# EAGLE design diy_mainboard (EAGLE 6.6.0)
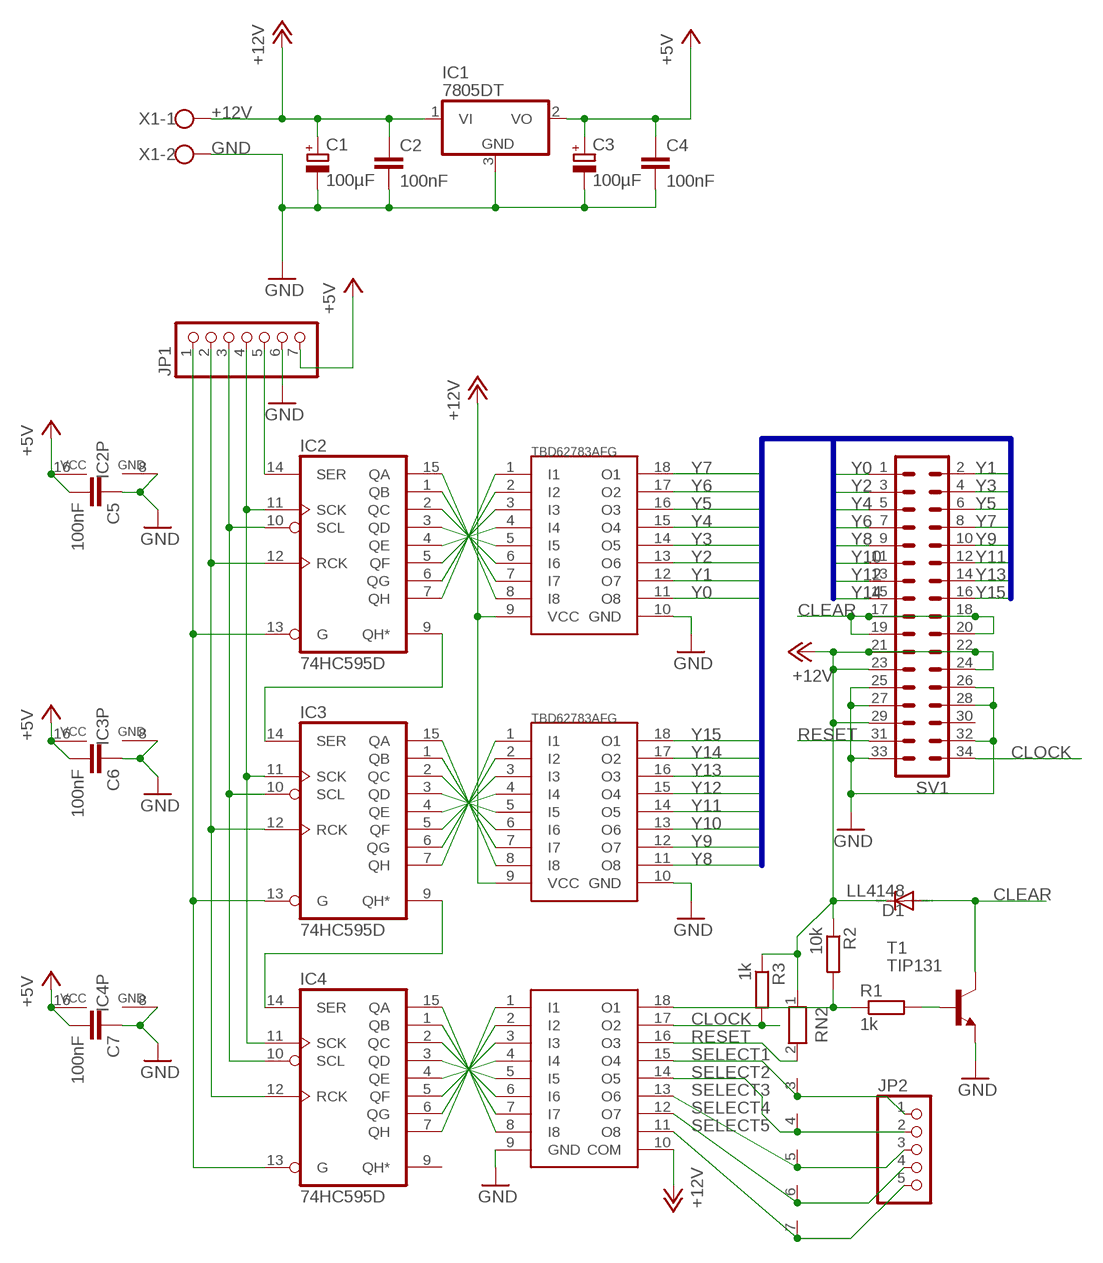
[diagram p0: schematic, sheet 1]

## Parts
C1  100µF  CPOL-EU153CLV-0605  [153CLV-0605]
C2  100nF  C-EUC0603  [C0603]
C3  100µF  CPOL-EU153CLV-0605  [153CLV-0605]
C4  100nF  C-EUC0603  [C0603]
C5  100nF  C-EUC0603  [C0603]
C6  100nF  C-EUC0603  [C0603]
C7  100nF  C-EUC0603  [C0603]
D1  LL4148  PMLL4150  [SOD80C]
IC1  7805DT  [TO252]
IC2  74HC595D  [SO16]
IC3  74HC595D  [SO16]
IC4  74HC595D  [SO16]
JP1  PINHD-1X7  [1X07]
JP2  PINHD-1X5  [1X05]
R1  1k  R-EU_R0805  [R0805]
R2  10k  R-EU_R0805  [R0805]
R3  1k  R-EU_R0805  [R0805]
RN2  RN06  [RN-7]
SV1  ML34  [ML34]
T1  TIP131  2SC1306  [TO220BV]
U$1  TBD62783AFG  [SO8-L]
U$2  TBD62783AFG  [SO8-L]
U$3  ULN2803  [SO8-L]
X1  W237-102  [W237-102]

## Nets
+5V: C3.+ C4.1 C5.2 C6.2 C7.2 IC1.2(VO) IC2.16(VCC) IC3.16(VCC) IC4.16(VCC) JP1.7
+12V: C1.+ C2.1 D1.C IC1.1(VI) R2.1 R3.1 RN2.1 SV1.21 SV1.22 SV1.23 SV1.24 SV1.29 U$1.9(VCC) U$2.9(VCC) U$3.10(COM) X1.1
CLEAR: D1.A SV1.17 SV1.18 SV1.19 SV1.20 T1.2(C)
CLOCK: R3.2 SV1.34 U$3.17(O2)
GND: C1.- C2.2 C3.- C4.2 C5.1 C6.1 C7.1 IC1.3(GND) IC2.8(GND) IC3.8(GND) IC4.8(GND) JP1.6 SV1.25 SV1.26 SV1.27 SV1.28 SV1.32 SV1.33 T1.3(E) U$1.10(GND) U$2.10(GND) U$3.9(GND) X1.2
N$1: IC2.15(QA) U$1.8(I8)
N$2: IC2.1(QB) U$1.7(I7)
N$3: IC2.2(QC) U$1.6(I6)
N$4: IC2.3(QD) U$1.5(I5)
N$5: IC2.4(QE) U$1.4(I4)
N$6: IC2.5(QF) U$1.3(I3)
N$7: IC2.6(QG) U$1.2(I2)
N$8: IC2.7(QH) U$1.1(I1)
N$9: IC3.15(QA) U$2.8(I8)
N$10: IC3.1(QB) U$2.7(I7)
N$11: IC3.2(QC) U$2.6(I6)
N$12: IC3.3(QD) U$2.5(I5)
N$13: IC3.4(QE) U$2.4(I4)
N$14: IC3.5(QF) U$2.3(I3)
N$15: IC3.6(QG) U$2.2(I2)
N$16: IC3.7(QH) U$2.1(I1)
N$17: IC2.9(QH*) IC3.14(SER)
N$18: IC2.11(SCK) IC3.11(SCK) IC4.11(SCK) JP1.4
N$19: IC2.10(SCL) IC3.10(SCL) IC4.10(SCL) JP1.3
N$20: IC2.12(RCK) IC3.12(RCK) IC4.12(RCK) JP1.2
N$21: IC2.13(G) IC3.13(G) IC4.13(G) JP1.1
N$22: IC3.9(QH*) IC4.14(SER)
N$23: IC4.15(QA) U$3.8(I8)
N$24: IC4.1(QB) U$3.7(I7)
N$25: IC4.2(QC) U$3.6(I6)
N$26: IC4.3(QD) U$3.5(I5)
N$27: IC4.4(QE) U$3.4(I4)
N$28: IC4.5(QF) U$3.3(I3)
N$29: IC4.6(QG) U$3.2(I2)
N$30: IC4.7(QH) U$3.1(I1)
N$31: R1.2 T1.1(B)
N$32: R1.1 R2.2 U$3.18(O1)
N$33: IC2.14(SER) JP1.5
RESET: RN2.2 SV1.31 U$3.16(O3)
SELECT1: JP2.1 RN2.3 U$3.15(O4)
SELECT2: JP2.2 RN2.4 U$3.14(O5)
SELECT3: JP2.3 RN2.5 U$3.13(O6)
SELECT4: JP2.4 RN2.6 U$3.12(O7)
SELECT5: JP2.5 RN2.7 U$3.11(O8)
Y0: SV1.1 U$1.11(O8)
Y1: SV1.2 U$1.12(O7)
Y2: SV1.3 U$1.13(O6)
Y3: SV1.4 U$1.14(O5)
Y4: SV1.5 U$1.15(O4)
Y5: SV1.6 U$1.16(O3)
Y6: SV1.7 U$1.17(O2)
Y7: SV1.8 U$1.18(O1)
Y8: SV1.9 U$2.11(O8)
Y9: SV1.10 U$2.12(O7)
Y10: SV1.11 U$2.13(O6)
Y11: SV1.12 U$2.14(O5)
Y12: SV1.13 U$2.15(O4)
Y13: SV1.14 U$2.16(O3)
Y14: SV1.15 U$2.17(O2)
Y15: SV1.16 U$2.18(O1)
Unconnected: IC4.9(QH*) SV1.30

## Buses
Y[0..15]

## Library data of the parts
C1 C3 = rcl:CPOL-EU: POLARIZED CAPACITOR, European symbol; DIGIKEY: 493-2203-1-ND
C2 C4-C7 = rcl:C-EU: CAPACITOR, European symbol; DIGIKEY: 478-5052-1-ND
D1 = diode:PMLL4150: DIODE high speed; DIGIKEY: LL4148FSCT-ND
IC1 = linear:78*: Positive VOLTAGE REGULATOR Source: http://cache.national.com/ds/LM/LM78L05.pdf http://www.fairchildsemi.com/ds/LM/LM7805.pdf; DIGIKEY: MC7805CDTGOS-ND
IC2-IC4 = 74xx-eu:74*595: 8-bit SHIFT REGISTER, output latch; DIGIKEY: 568-2263-1-ND
JP1 = pinhead:PINHD-1X7: PIN HEADER; DIGIKEY: A101735CT-ND
JP2 = pinhead:PINHD-1X5: PIN HEADER; DIGIKEY: A101735CT-ND
R1 R3 = rcl:R-EU_: RESISTOR, European symbol; DIGIKEY: RMCF0805JT1K00CT-ND
R2 = rcl:R-EU_: RESISTOR, European symbol; DIGIKEY: RMCF0805JT10K0CT-ND
RN2 = resistor-net:RN06: RESISTOR NETWORK; DIGIKEY: 4607X-101-472LF-ND; OC_FARNELL: unknown; OC_NEWARK: unknown
SV1 = con-harting-ml:ML34: HARTING; DIGIKEY: AE11226-ND; OC_FARNELL: unknown; OC_NEWARK: unknown
T1 = transistor:2SC1306: NPN Transistor Final RF Power Outupt Source: 2sc1306.pdf
U$1 U$2 = DIY:TBD62783AFG; DIGIKEY: TBD62783AFGELCT-ND
U$3 = DIY:ULN2803; DIGIKEY: 296-15777-1-ND
X1 = con-wago-500:W237-102: WAGO SCREW CLAMP; MPN: 237-102; OC_FARNELL: unknown; OC_NEWARK: 70K9898

## Board
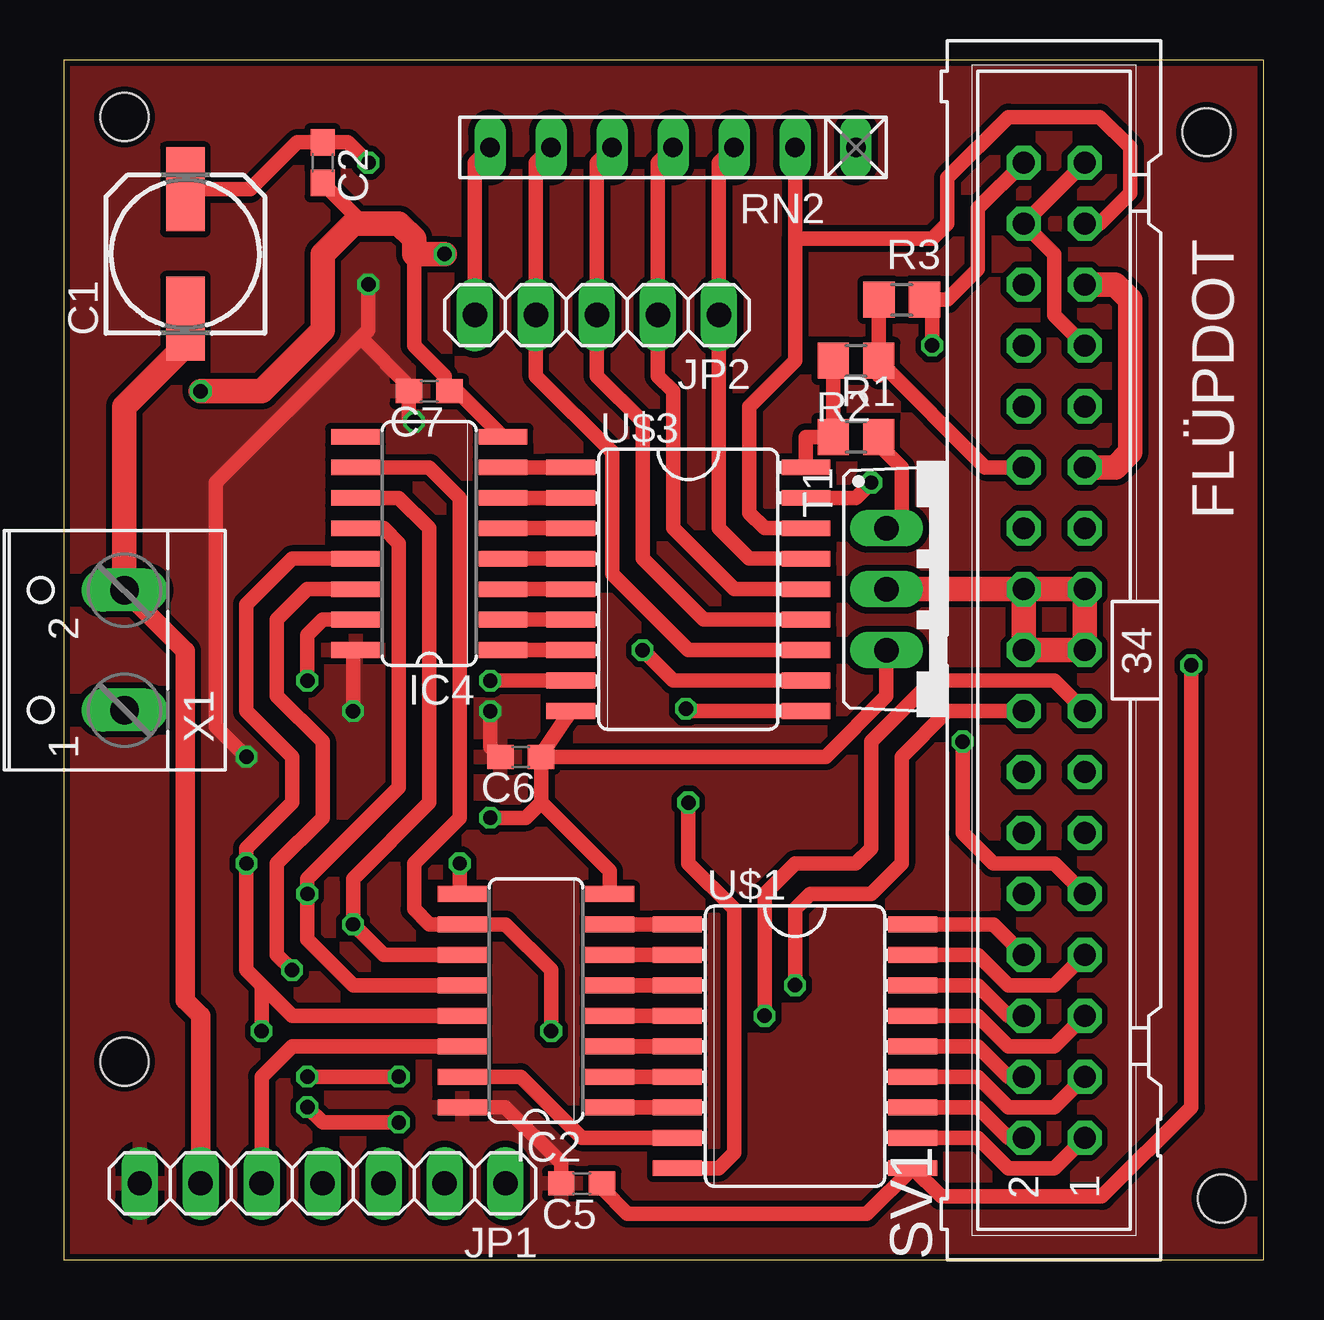
[diagram p1: board, top side]
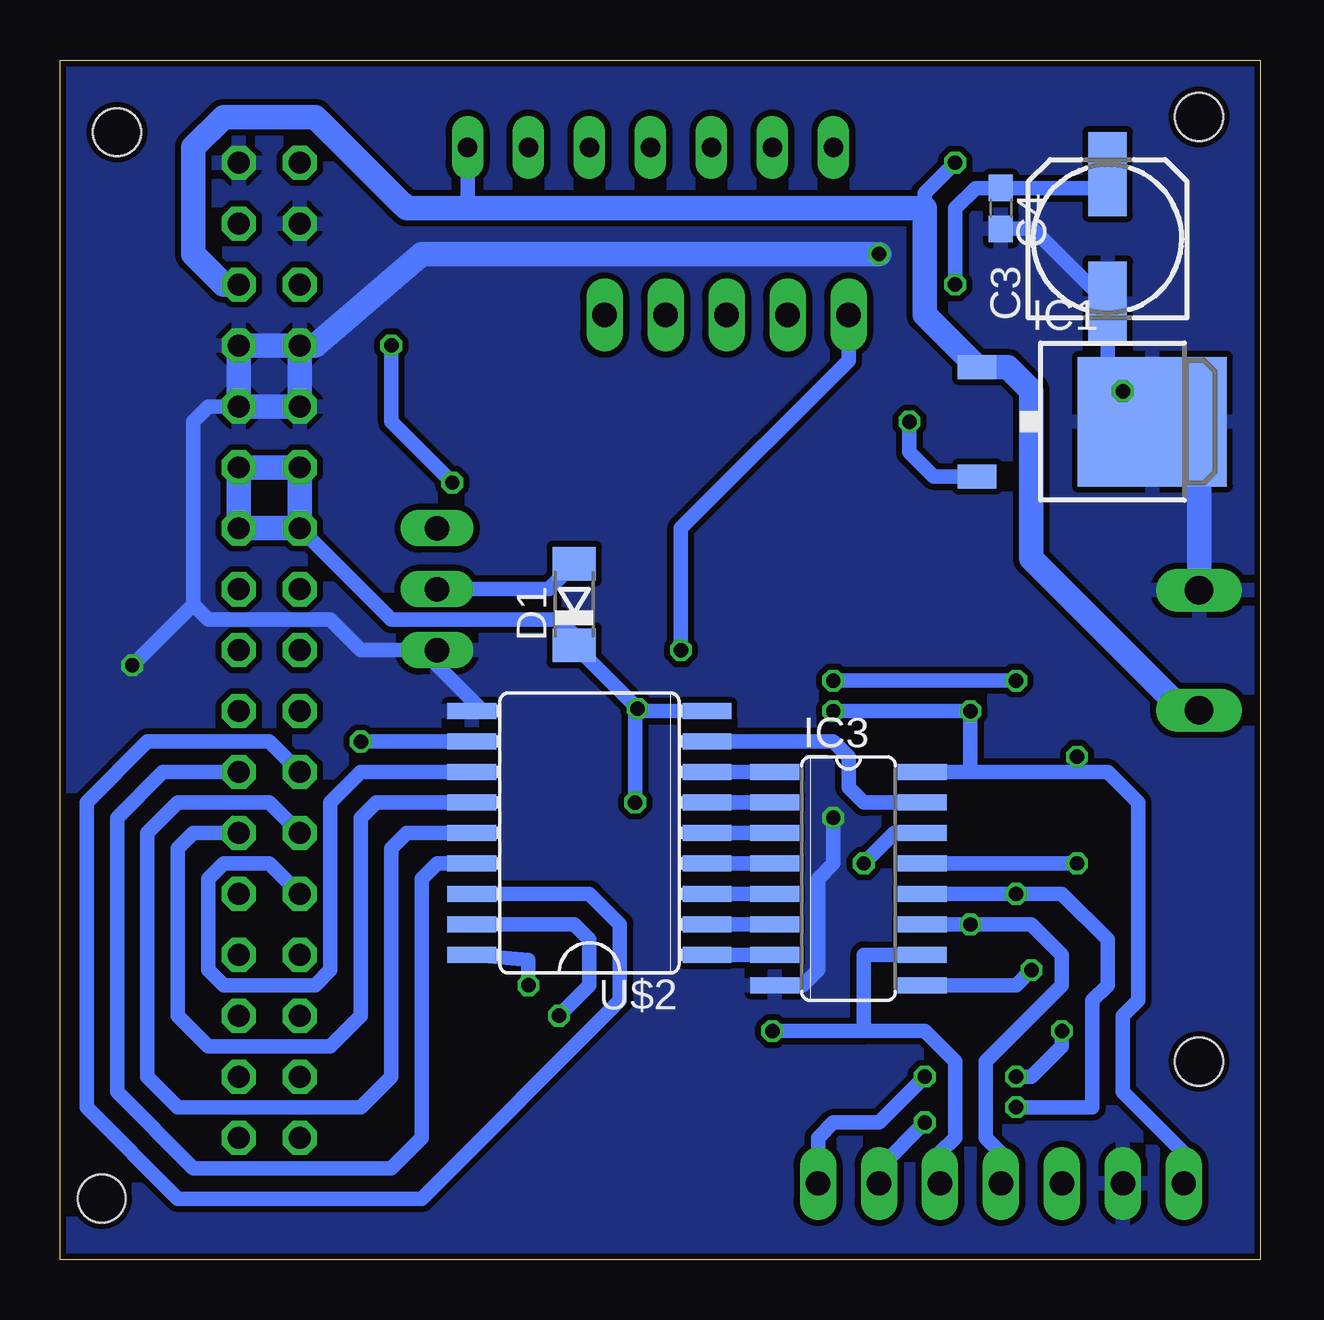
[diagram p2: board, bottom side, seen from below]

Size 50 x 50 mm. Coordinates in mm from the lower left corner, seen from the top.
Outline: 0,0 50,0 50,50 0,50 0,0
Copper layers (1*16): Top 0.035mm / dielectric 1.5mm / Bottom 0.035mm
Design rules "dirt_cheap_dirty_boards.v1": minimum track width 5mil, minimum drill 12mil, track to track 5mil, track to pad 5mil, pad to pad 5mil, via to via 5mil, smd to smd 0mil, copper to edge 10mil, drill to drill 10mil, minimum pad ring 10mil, minimum via ring 6mil, stop-mask expansion 2mil, vias tented up to drill 25mil, thermal gap 10mil
Holes 2 mm at 47.62,46.99 2.54,8.26 2.54,47.62 48.26,2.54

### Footprints (pad centres in the part's own frame; a part is rotated, then mirrored left to right if it is on the bottom)
153CLV-0605 = smd 3.5 x 1.6: + 2.7,0; - -2.7,0
C0603 = smd 1.1 x 1: 1 -0.85,0; 2 0.85,0
SOD80C = smd 1.4 x 1.8: A 1.7,0; C -1.7,0
TO252 = smd 1 x 1.6: 1 -2.28,-4.8; 2 2.28,-4.8 | smd 5.4 x 6.2: 3 0,2.5
SO16 = smd 0.66 x 2.032: 1 -4.445,-3.073; 2 -3.175,-3.073; 3 -1.905,-3.073; 4 -0.635,-3.073; 5 0.635,-3.073; 6 1.905,-3.073; 7 3.175,-3.073; 8 4.445,-3.073; 9 4.445,3.073; 10 3.175,3.073; 11 1.905,3.073; 12 0.635,3.073; 13 -0.635,3.073; 14 -1.905,3.073; 15 -3.175,3.073; 16 -4.445,3.073
1X07 = drill 1.016 long: 1 -7.62,0; 2 -5.08,0; 3 -2.54,0; 4 0,0; 5 2.54,0; 6 5.08,0; 7 7.62,0
1X05 = drill 1.016 long: 1 -5.08,0; 2 -2.54,0; 3 0,0; 4 2.54,0; 5 5.08,0
R0805 = smd 1.3 x 1.5: 1 -0.95,0; 2 0.95,0
RN-7 = drill 0.813 long: 1 -7.62,0; 2 -5.08,0; 3 -2.54,0; 4 0,0; 5 2.54,0; 6 5.08,0; 7 7.62,0
ML34 = drill 0.914 octagon: 1 -20.32,-1.27; 2 -20.32,1.27; 3 -17.78,-1.27; 4 -17.78,1.27; 5 -15.24,-1.27; 6 -15.24,1.27; 7 -12.7,-1.27; 8 -12.7,1.27; 9 -10.16,-1.27; 10 -10.16,1.27; 11 -7.62,-1.27; 12 -7.62,1.27; 13 -5.08,-1.27; 14 -5.08,1.27; 15 -2.54,-1.27; 16 -2.54,1.27; 17 0,-1.27; 18 0,1.27; 19 2.54,-1.27; 20 2.54,1.27; 21 5.08,-1.27; 22 5.08,1.27; 23 7.62,-1.27; 24 7.62,1.27; 25 10.16,-1.27; 26 10.16,1.27; 27 12.7,-1.27; 28 12.7,1.27; 29 15.24,-1.27; 30 15.24,1.27; 31 17.78,-1.27; 32 17.78,1.27; 33 20.32,-1.27; 34 20.32,1.27
TO220BV = drill 1.016 long: 1 -2.54,-2.54; 2 0,-2.54; 3 2.54,-2.54
SO8-L = smd 0.66 x 2.032: 1 -5.08,-4.902; 2 -3.81,-4.902; 3 -2.54,-4.902; 4 -1.27,-4.902; 5 0,-4.902; 6 1.27,-4.902; 7 2.54,-4.902; 8 3.81,-4.902; 9 5.08,-4.902; 10 5.08,4.902; 11 3.81,4.902; 12 2.54,4.902; 13 1.27,4.902; 14 0,4.902; 15 -1.27,4.902; 16 -2.54,4.902; 17 -3.81,4.902; 18 -5.08,4.902
W237-102 = drill 1.194 long: 1 -2.5,-1.27; 2 2.5,-1.27

### Placement (x,y rotation side)
C1  5.08,41.91 90 top
C2  10.79,45.72 270 top
C3  6.35,42.55 90 bottom
C4  10.79,43.81 270 bottom
C5  21.59,3.17 180 top
C6  19.05,20.95 180 top
C7  15.24,36.2 180 top
D1  28.57,27.3 90 bottom
IC1  6.99,34.92 270 bottom
IC2  19.68,10.79 90 top
IC3  17.14,15.88 270 bottom
IC4  15.24,29.84 90 top
JP1  10.79,3.17 180 top
JP2  22.23,39.37 180 top
R1  33.02,34.29 0 top
R2  33.02,37.47 180 top
R3  34.92,40.01 0 top
RN2  25.4,46.35 180 top
SV1  41.27,25.4 90 top
T1  36.83,27.94 270 top
U$1  30.48,8.89 270 top
U$2  27.94,17.78 90 bottom
U$3  26.04,27.94 270 top
X1  1.27,25.4 90 top

### Tracks (layer width: path | path; a pad name or v marks a point on that pad's centre or on a via)
+5V  (via drill 0.6)
  Top 0.61: IC4.16 12.06,25.4 v12.06,22.86 | C5.2 20.74,4.03 18.41,6.35 IC2.16 | 12.38,38.42 12.7,38.73 v12.7,40.64 | 12.38,38.42 6.35,32.38 6.35,22.23 v7.62,20.95 | v17.78,22.86 17.78,21.38 C6.2 | 12.38,38.42 14.39,36.41 C7.2 14.39,35.14 v14.61,34.92
  Bottom 0.61: JP1.7 3.17,4.45 5.71,6.99 5.71,10.16 5.08,10.79 5.08,19.05 6.35,20.32 7.62,20.32 | 7.62,20.32 12.06,20.32 | 12.06,20.32 IC3.16 | 12.06,20.32 v12.06,22.86 v17.78,22.86 | v12.7,40.64 12.7,43.81 11.85,44.66 C4.1 6.93,44.66 C3.+ | v7.62,20.95 7.62,20.32 | v14.61,34.92 14.61,33.66 13.6,32.65 IC1.2
  pour Top (isolate 0.254): 0,0 0,50.16 50.16,50.16 50.16,0
+12V  (via drill 0.6)
  Top 0.61: U$1.9 27.3,3.81 27.94,4.45 27.94,14.61 26.04,16.51 v26.04,19.05 | R2.1 33.98,36.84 | v12.7,45.72 11.85,46.57 C2.1 9.74,46.57 7.78,44.61 C1.+ | U$3.10 26.04,22.86 v25.93,22.96 | R3.1 R2.1 | R2.1 38.41,33.02 SV1.24
  Top 1.016: SV1.29 43.81,40.64 44.45,40.01 44.45,33.66 43.81,33.02 SV1.23
  Bottom 0.61: 25.83,22.86 U$2.9 | v26.04,19.05 26.04,22.66 25.83,22.86 | SV1.22 36.2,26.67 29.21,26.67 28.57,26.04 D1.C v25.93,22.96 25.83,22.86 | 35.56,44.13 35.88,44.13 | v12.7,45.72 13.97,44.45 13.97,43.81 | RN2.1 33.02,43.81
  Bottom 1.016: X1.1 3.21,22.9 9.53,29.21 9.53,36.22 10.52,37.2 IC1.1 13.97,39.39 13.97,43.81 33.02,43.81 35.56,43.81 35.88,44.13 39.37,47.62 43.18,47.62 44.45,46.35 44.45,41.91 43.18,40.64 SV1.29 | SV1.23 SV1.24 SV1.22 SV1.21 SV1.23
CLEAR
  Top 1.016: SV1.20 SV1.19 SV1.17 SV1.18 SV1.20 | T1.2 SV1.20
  Bottom 0.61: D1.A 29.64,27.94 T1.2
CLOCK  (via drill 0.6)
  Top 0.61: U$3.17 33.02,31.75 v33.66,32.38 | v36.2,38.1 36.2,39.37 R3.2 36.83,40.01 38.1,41.27 38.1,43.81 SV1.34
  Bottom 0.61: v33.66,32.38 36.2,34.92 v36.2,38.1
GND  (via drill 0.6)
  Top 0.61: SV1.33 SV1.32 41.27,41.91 41.27,39.37 SV1.27 | C5.1 22.44,2.96 23.5,1.91 33.48,1.91 U$1.10 36.56,2.63 43.27,2.63 46.99,6.35 v46.99,24.77 | IC2.8 22.76,16.19 19.9,19.05 | v17.78,18.41 19.27,18.41 19.9,19.05 | 14.61,41.91 14.61,38.1 15.88,36.83 15.88,36.41 C7.1 16.41,36.2 IC4.8 | C2.2 12.48,43.18 12.7,43.18 | U$3.9 19.86,20.99 C6.1 | C6.1 19.9,19.05 | T1.3 34.29,23.5 31.75,20.95 C6.1
  Top 0.813: JP1.6 5.71,10.16 5.08,10.79 5.08,25.36 X1.2
  Top 1.016: X1.2 2.54,35.56 5.08,38.1 C1.- | v15.88,41.91 14.61,41.91 14.61,42.55 13.97,43.18 12.7,43.18 12.06,43.18 10.79,41.91 10.79,38.73 8.26,36.2 v5.71,36.2
  Bottom 0.61: U$2.10 32.38,22.86 34.29,24.77 T1.3 37.47,25.4 38.73,26.67 43.81,26.67 44.45,27.3 | 44.45,27.3 44.45,34.92 43.81,35.56 SV1.25 | IC3.8 19.05,11.43 18.41,12.06 18.41,15.88 17.78,16.51 v17.78,18.41 | v5.71,36.2 5.08,35.56 5.08,36.23 IC1.3 6.35,36.79 C3.- 9.47,42.97 C4.2 | v46.99,24.77 44.45,27.3
  Bottom 1.016: SV1.28 SV1.27 SV1.25 SV1.26 SV1.28 | X1.2 2.54,36.79 IC1.3 | SV1.28 39.37,38.1 34.92,41.91 v15.88,41.91
  pour Bottom (isolate 0.254): 0,0 0,50.16 50.16,50.16 50.16,0
N$1
  Top 0.61: IC2.15 19.05,7.62 21.59,5.08 U$1.8
N$2
  Top 0.61: IC2.1 U$1.7
N$3
  Top 0.61: IC2.2 U$1.6
N$4
  Top 0.61: IC2.3 U$1.5
N$5
  Top 0.61: IC2.4 U$1.4
N$6
  Top 0.61: IC2.5 U$1.3
N$7
  Top 0.61: IC2.6 U$1.2
N$8
  Top 0.61: U$1.1 IC2.7
N$9
  Bottom 0.61: IC3.15 16.51,19.05 17.14,19.68 17.14,20.95 17.78,21.59 U$2.8
N$10
  Bottom 0.61: IC3.1 U$2.7
N$11
  Bottom 0.61: IC3.2 U$2.6
N$12
  Bottom 0.61: IC3.3 U$2.5
N$13
  Bottom 0.61: IC3.4 U$2.4
N$14
  Bottom 0.61: IC3.5 U$2.3
N$15
  Bottom 0.61: IC3.6 U$2.2
N$16
  Bottom 0.61: IC3.7 U$2.1
N$17  (via drill 0.6)
  Top 0.61: v16.51,16.51 16.51,15.34 IC2.9
  Bottom 0.61: 13.97,17.78 IC3.14 15.24,17.78 v16.51,16.51
N$18  (via drill 0.6)
  Top 0.61: IC4.11 13.97,31.75 15.24,30.48 15.24,19.05 12.06,15.88 v12.06,13.97 13.34,12.7 IC2.11
  Bottom 0.61: IC3.11 v12.06,13.97 9.53,13.97 8.26,12.7 8.26,11.43 11.43,8.26 11.43,5.08 10.79,4.45 JP1.4
N$19  (via drill 0.6)
  Top 0.61: IC4.10 15.24,33.02 16.51,31.75 16.51,18.41 14.61,16.51 14.61,14.61 15.24,13.97 IC2.10 18.41,13.97 20.32,12.06 v20.32,9.53
  Bottom 0.61: JP1.3 13.34,4.45 12.7,5.08 12.7,8.26 13.97,9.53 16.51,9.53 | 16.51,9.53 16.51,12.7 IC3.10 | v20.32,9.53 16.51,9.53
N$20  (via drill 0.6)
  Top 0.61: IC4.12 13.34,30.48 13.97,29.84 13.97,19.68 10.16,15.88 v10.16,15.24 10.16,13.34 12.06,11.43 IC2.12 | v10.16,6.35 10.79,5.71 v13.97,5.71
  Bottom 0.61: IC3.12 v10.16,15.24 8.26,15.24 6.35,13.34 6.35,11.43 6.99,10.79 6.99,6.35 v10.16,6.35 | v13.97,5.71 15.88,3.81 JP1.2
N$21  (via drill 0.6)
  Top 0.61: 8.26,11.43 7.62,12.06 v7.62,16.51 7.62,17.14 9.53,19.05 9.53,20.95 7.62,22.86 7.62,27.3 9.53,29.21 IC4.13 | 8.26,11.43 9.53,10.16 IC2.13 | 8.26,11.43 v8.26,9.53 | v10.16,7.62 v13.97,7.62
  Bottom 0.61: v7.62,16.51 IC3.13 | v8.26,9.53 8.26,8.89 9.53,7.62 v10.16,7.62 | v13.97,7.62 15.88,5.71 17.78,5.71 18.41,5.08 JP1.1
N$22  (via drill 0.6)
  Top 0.61: v9.53,12.06 8.89,12.7 8.89,16.51 10.79,18.41 10.79,21.59 8.89,23.5 8.89,26.67 10.16,27.94 IC4.14
  Bottom 0.61: v9.53,12.06 10.16,11.43 IC3.9
N$23  (via drill 0.6)
  Top 0.61: v10.16,24.13 10.16,26.04 10.79,26.67 IC4.15 | v17.78,24.13 U$3.8
  Bottom 0.61: v10.16,24.13 v17.78,24.13
N$24
  Top 0.61: IC4.1 U$3.7
N$25
  Top 0.61: IC4.2 U$3.6
N$26
  Top 0.61: IC4.3 U$3.5
N$27
  Top 0.61: IC4.4 U$3.4
N$28
  Top 0.61: IC4.5 U$3.3
N$29
  Top 0.61: IC4.6 U$3.2
N$30
  Top 0.61: IC4.7 U$3.1
N$31
  Top 0.61: T1.1 34.92,31.11 34.92,33.02 33.97,33.98 R1.2
N$32
  Top 0.61: R2.2 R1.1 30.94,34.29 U$3.18
N$33
  Top 0.61: IC2.14 9.53,8.89 8.26,7.62 JP1.5
RESET
  Top 0.61: SV1.31 43.18,43.18 44.45,44.45 44.45,46.35 43.18,47.62 39.37,47.62 36.83,45.09 36.83,43.18 36.2,42.55 30.48,42.55 | U$3.16 29.21,30.48 28.57,31.11 28.57,35.56 30.48,37.47 30.48,42.55 | RN2.2 30.48,42.55
SELECT1
  Top 0.61: RN2.3 27.3,45.72 JP2.1 27.3,30.48 28.57,29.21 U$3.15
SELECT2
  Top 0.61: RN2.4 24.77,45.72 JP2.2 24.77,36.83 25.4,36.2 25.4,30.48 27.94,27.94 U$3.14
SELECT3
  Top 0.61: RN2.5 22.23,45.72 JP2.3 22.23,36.83 24.13,34.92 24.13,29.21 26.67,26.67 U$3.13
SELECT4
  Top 0.61: RN2.6 19.68,45.72 JP2.4 19.68,36.83 22.86,33.66 22.86,28.57 26.04,25.4 U$3.12
SELECT5  (via drill 0.6)
  Top 0.61: RN2.7 17.14,45.72 JP2.5 | U$3.11 25.4,24.13 v24.13,25.4
  Bottom 0.61: v24.13,25.4 24.13,30.48 17.14,37.47 JP2.5
Y0
  Top 0.61: U$1.11 38.1,5.08 39.37,3.81 41.27,3.81 SV1.1
Y1
  Top 0.61: U$1.12 38.1,6.35 39.37,5.08 SV1.2
Y2
  Top 0.61: U$1.13 38.1,7.62 39.37,6.35 41.27,6.35 SV1.3
Y3
  Top 0.61: U$1.14 38.1,8.89 39.37,7.62 SV1.4
Y4
  Top 0.61: U$1.15 38.1,10.16 39.37,8.89 41.27,8.89 SV1.5
Y5
  Top 0.61: U$1.16 38.1,11.43 39.37,10.16 SV1.6
Y6
  Top 0.61: U$1.17 38.1,12.7 39.37,11.43 41.27,11.43 SV1.7
Y7
  Top 0.61: U$1.18 38.73,13.97 SV1.8
Y8  (via drill 0.6)
  Top 0.61: v37.47,21.59 37.47,17.78 38.73,16.51 41.27,16.51 SV1.9
  Bottom 0.61: U$2.11 v37.47,21.59
Y9
  Bottom 0.61: U$2.12 37.47,20.32 38.73,19.05 38.73,12.06 39.37,11.43 43.18,11.43 43.81,12.06 43.81,15.88 43.18,16.51 41.27,16.51 SV1.10
Y10
  Bottom 0.61: U$2.13 36.83,19.05 37.47,18.41 37.47,10.16 38.73,8.89 43.81,8.89 45.09,10.16 45.09,17.14 44.45,17.78 SV1.11
Y11
  Bottom 0.61: U$2.14 35.56,17.78 36.2,17.14 36.2,7.62 37.47,6.35 45.09,6.35 46.35,7.62 46.35,17.78 45.09,19.05 41.27,19.05 SV1.12
Y12
  Bottom 0.61: U$2.15 34.29,16.51 34.92,15.88 34.92,5.08 36.2,3.81 44.45,3.81 47.62,6.99 47.62,18.41 45.72,20.32 SV1.13
Y13
  Bottom 0.61: 32.38,15.24 U$2.16 27.94,15.24 26.67,13.97 26.67,10.79 34.92,2.54 45.09,2.54 48.9,6.35 48.9,19.05 46.35,21.59 41.27,21.59 SV1.14
Y14  (via drill 0.6)
  Top 0.61: SV1.15 41.27,24.13 36.2,24.13 33.66,21.59 33.66,17.14 33.02,16.51 30.48,16.51 29.21,15.24 v29.21,10.16
  Bottom 0.61: U$2.17 28.57,13.97 27.94,13.34 27.94,11.43 v29.21,10.16
Y15  (via drill 0.6)
  Top 0.61: SV1.16 36.83,22.86 34.92,20.95 34.92,16.51 33.66,15.24 31.11,15.24 30.48,14.61 v30.48,11.43
  Bottom 0.61: U$2.18 30.48,12.49 v30.48,11.43

### Text on the board
tNames: FLÜPDOT
tDocu: SELECT | 5 | 4 | 3 | 2 | 1 | 5V | GND | SER | SCK | SCL | RCK | OE